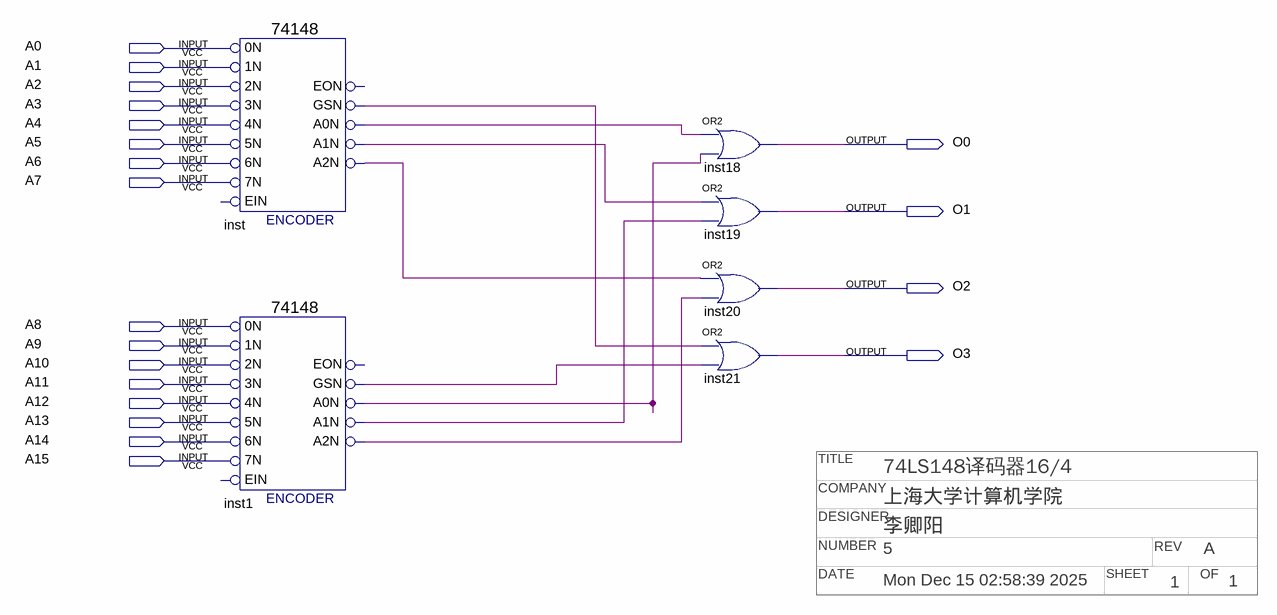
[diagram p0: schematic sheet]
// Quartus schematic sikao2.bdf as structural Verilog: 6 symbols, 20 pins
// Title block: TITLE: 74LS148译码器16/4; COMPANY: 上海大学计算机学院; DESIGNER: 李卿阳; NUMBER: 5; REV: A; DATE: Mon Dec 15 02:58:39 2025; SHEET: 1; OF: 1
module sikao2 (
  input  A0,
  input  A1,
  input  A2,
  input  A3,
  input  A4,
  input  A5,
  input  A6,
  input  A7,
  input  A8,
  input  A9,
  input  A10,
  input  A11,
  input  A12,
  input  A13,
  input  A14,
  input  A15,
  output O0,
  output O1,
  output O2,
  output O3
);

  wire inst1_a0n, inst1_a1n, inst1_a2n, inst1_gsn, inst_a0n, inst_a1n, inst_a2n, inst_gsn;

  \74148  inst (
    .\5N (A5), .\0N (A0), .\1N (A1), .\2N (A2), .\3N (A3), .\4N (A4), .\6N (A6), .\7N (A7), .A1N(inst_a1n),
    .A0N(inst_a0n), .A2N(inst_a2n), .GSN(inst_gsn));  // open: EIN, EON
  \74148  inst1 (
    .\5N (A13), .\0N (A8), .\1N (A9), .\2N (A10), .\3N (A11), .\4N (A12), .\6N (A14), .\7N (A15),
    .A1N(inst1_a1n), .A0N(inst1_a0n), .A2N(inst1_a2n), .GSN(inst1_gsn));  // open: EIN, EON
  or inst18 (O0, inst_a0n, inst1_a0n);
  or inst19 (O1, inst_a1n, inst1_a1n);
  or inst20 (O2, inst_a2n, inst1_a2n);
  or inst21 (O3, inst_gsn, inst1_gsn);
endmodule
